# EAGLE design NEW-PCB (EAGLE 9.0.0)
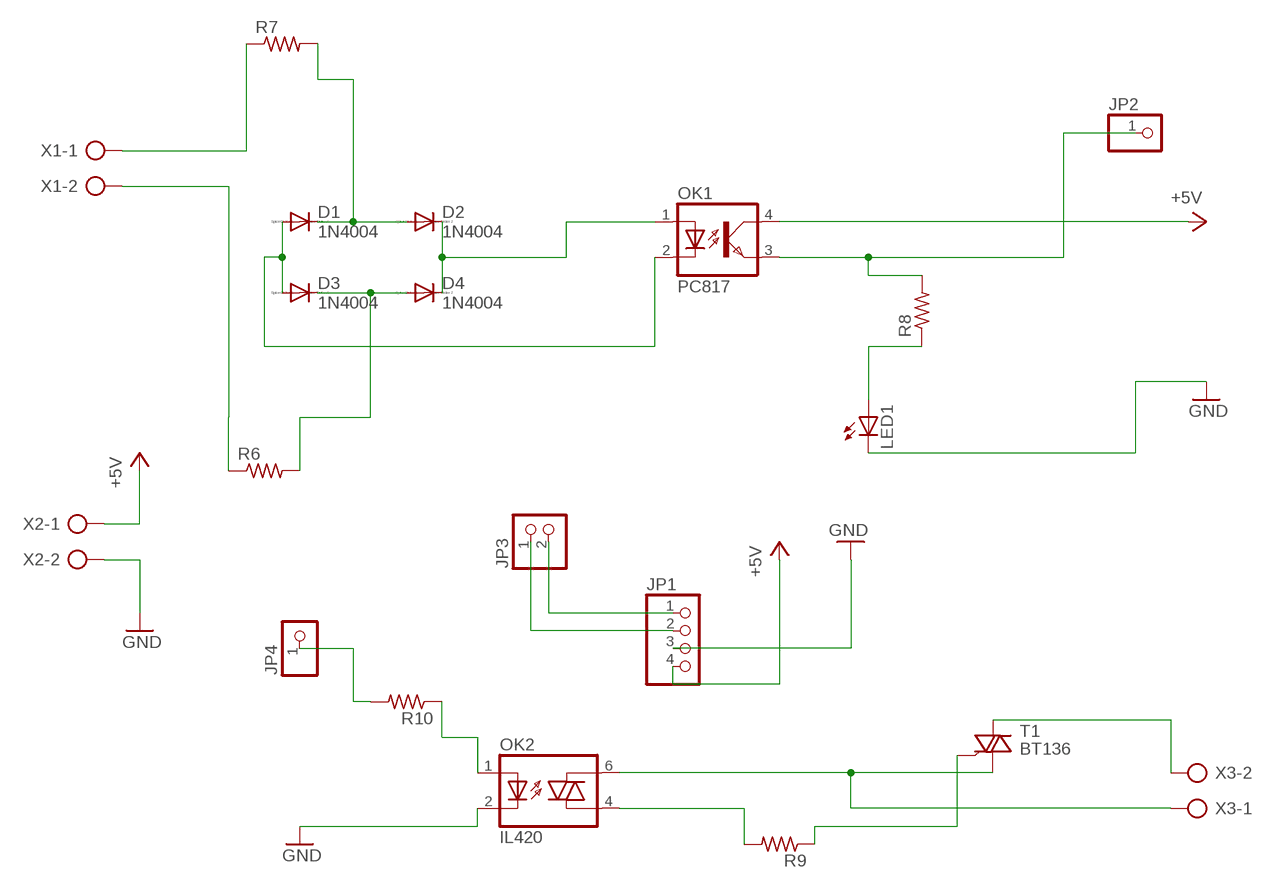
[diagram p0: schematic, sheet 1]

## Parts
D1  1N4004  [DO41-10]
D2  1N4004  [DO41-10]
D3  1N4004  [DO41-10]
D4  1N4004  [DO41-10]
JP1  PINHD-1X4  [1X04]
JP2  PINHD-1X1  [1X01]
JP3  PINHD-1X2  [1X02]
JP4  PINHD-1X1  [1X01]
LED1  LED5MM  [LED5MM]
OK1  PC817  [DIL04]
OK2  IL420  [DIL06]
R6  R-US_0411/15  [0411/15]
R7  R-US_0411/15  [0411/15]
R8  R-US_0411/15  [0411/15]
R9  R-US_0411/15  [0411/15]
R10  R-US_0411/15  [0411/15]
T1  BT136  [TO220AB]
X1  AK300/2  [AK300/2]
X2  AK300/2  [AK300/2]
X3  AK300/2  [AK300/2]

## Nets
+5V: JP1.4 OK1.4(COL) X2.1
GND: JP1.3 LED1.K(C) OK2.2(C) X2.2
N$1: R7.1 X1.1
N$2: R6.1 X1.2
N$3: D3.C D4.A R6.2
N$4: D1.C D2.A R7.2
N$5: D1.A D3.A OK1.2(C)
N$6: D2.C D4.C OK1.1(A)
N$7: JP1.1 JP3.2
N$8: LED1.A R8.1
N$9: JP2.1 OK1.3(EMIT) R8.2
N$10: JP1.2 JP3.1
N$11: JP4.1 R10.2
N$12: OK2.1(A) R10.1
N$13: OK2.6(A2) T1.1(A1) X3.1
N$14: T1.2(A2) X3.2
N$15: OK2.4(A1) R9.2
N$16: R9.1 T1.3(G)

## Library data of the parts
D1-D4 = diode:1N4004: DIODE general purpose rectifier, 1 A
JP1 = pinhead:PINHD-1X4: PIN HEADER
JP2 JP4 = pinhead:PINHD-1X1: PIN HEADER
JP3 = pinhead:PINHD-1X2: PIN HEADER
LED1 = led:LED: LED OSRAM: - CHIPLED LG R971, LG N971, LY N971, LG Q971, LY Q971, LO R971, LY R971 LH N974, LH R974 LS Q976, LO Q976, LY Q976 LO Q996 - Hyper CHIPLED LW Q18S LB Q993, LB Q99A, LB R99A - SideLED LS A670, LO A670, LY A670, LG A670, LP A670 LB A673, LV A673, LT A673, LW A673 LH A674 LY A675 LS A676, LA A676, LO A676, LY A676, LW A676 LS A679, LY A679, LG A679 - Hyper Micro SIDELED® LS Y876, LA Y876, LO Y876, LY Y876 LT Y87S - SmartLED LW L88C, LW L88S LB L89C, LB L89S, LG L890 LS L89K, LO L89K, LY L89K LS L896, LA L896, LO L896, LY L896 - TOPLED LS T670, LO T670, LY T670, LG T670, LP T670 LSG T670, LSP T670, LSY T670, LOP T670, LYG T670 LG T671, LOG T671, LSG T671 LB T673, LV T673, LT T673, LW T673 LH T674 LS T676, LA T676, LO T676, LY T676, LB T676, LH T676, LSB T676, LW T676 LB T67C, LV T67C, LT T67C, LS T67K, LO T67K, LY T67K, LW E67C LS E67B, LA E67B, LO E67B, LY E67B, LB E67C, LV E67C, LT E67C LW T67C LS T679, LY T679, LG T679 LS T770, LO T770, LY T770, LG T770, LP T770 LB T773, LV T773, LT T773, LW T773 LH T774 LS E675, LA E675, LY E675, LS T675 LS T776, LA T776, LO T776, LY T776, LB T776 LHGB T686 LT T68C, LB T68C - Hyper Mini TOPLED® LB M676 - Mini TOPLED Santana® LG M470 LS M47K, LO M47K, LY M47K Source: http://www.osram.convergy.de LUXEON: - LUMILED® LXK2-PW12-R00, LXK2-PW12-S00, LXK2-PW14-U00, LXK2-PW14-V00 LXK2-PM12-R00, LXK2-PM12-S00, LXK2-PM14-U00 LXK2-PE12-Q00, LXK2-PE12-R00, LXK2-PE12-S00, LXK2-PE14-T00, LXK2-PE14-U00 LXK2-PB12-K00, LXK2-PB12-L00, LXK2-PB12-M00, LXK2-PB14-N00, LXK2-PB14-P00, LXK2-PB14-Q00 LXK2-PR12-L00, LXK2-PR12-M00, LXK2-PR14-Q00, LXK2-PR14-R00 LXK2-PD12-Q00, LXK2-PD12-R00, LXK2-PD12-S00 LXK2-PH12-R00, LXK2-PH12-S00 LXK2-PL12-P00, LXK2-PL12-Q00, LXK2-PL12-R00 Source: www.luxeon.com KINGBRIGHT: KA-3528ASYC Source: www.kingbright.com
OK1 = optocoupler:PC817: SHARP OPTO COUPLER; MPN: PC817X4J000F; OC_FARNELL: 9707727; OC_NEWARK: 97K7059
OK2 = optocoupler:IL420: SIEMENS OPTO COUPLER; MF: VISHAY/TELEFUNKEN; MPN: IL420; OC_FARNELL: 1469561; OC_NEWARK: 58K1719
R6-R10 = resistor:R-US_: RESISTOR, American symbol
T1 = triac:BT136: Triac BT136 series E sensitive gate Source: http://www.nxp.com/acrobat_download/datasheets/BT136_SERIES_E_2.pdf
X1-X3 = con-ptr500:AK300/2: CONNECTOR; OC_FARNELL: unknown; OC_NEWARK: unknown

## Board
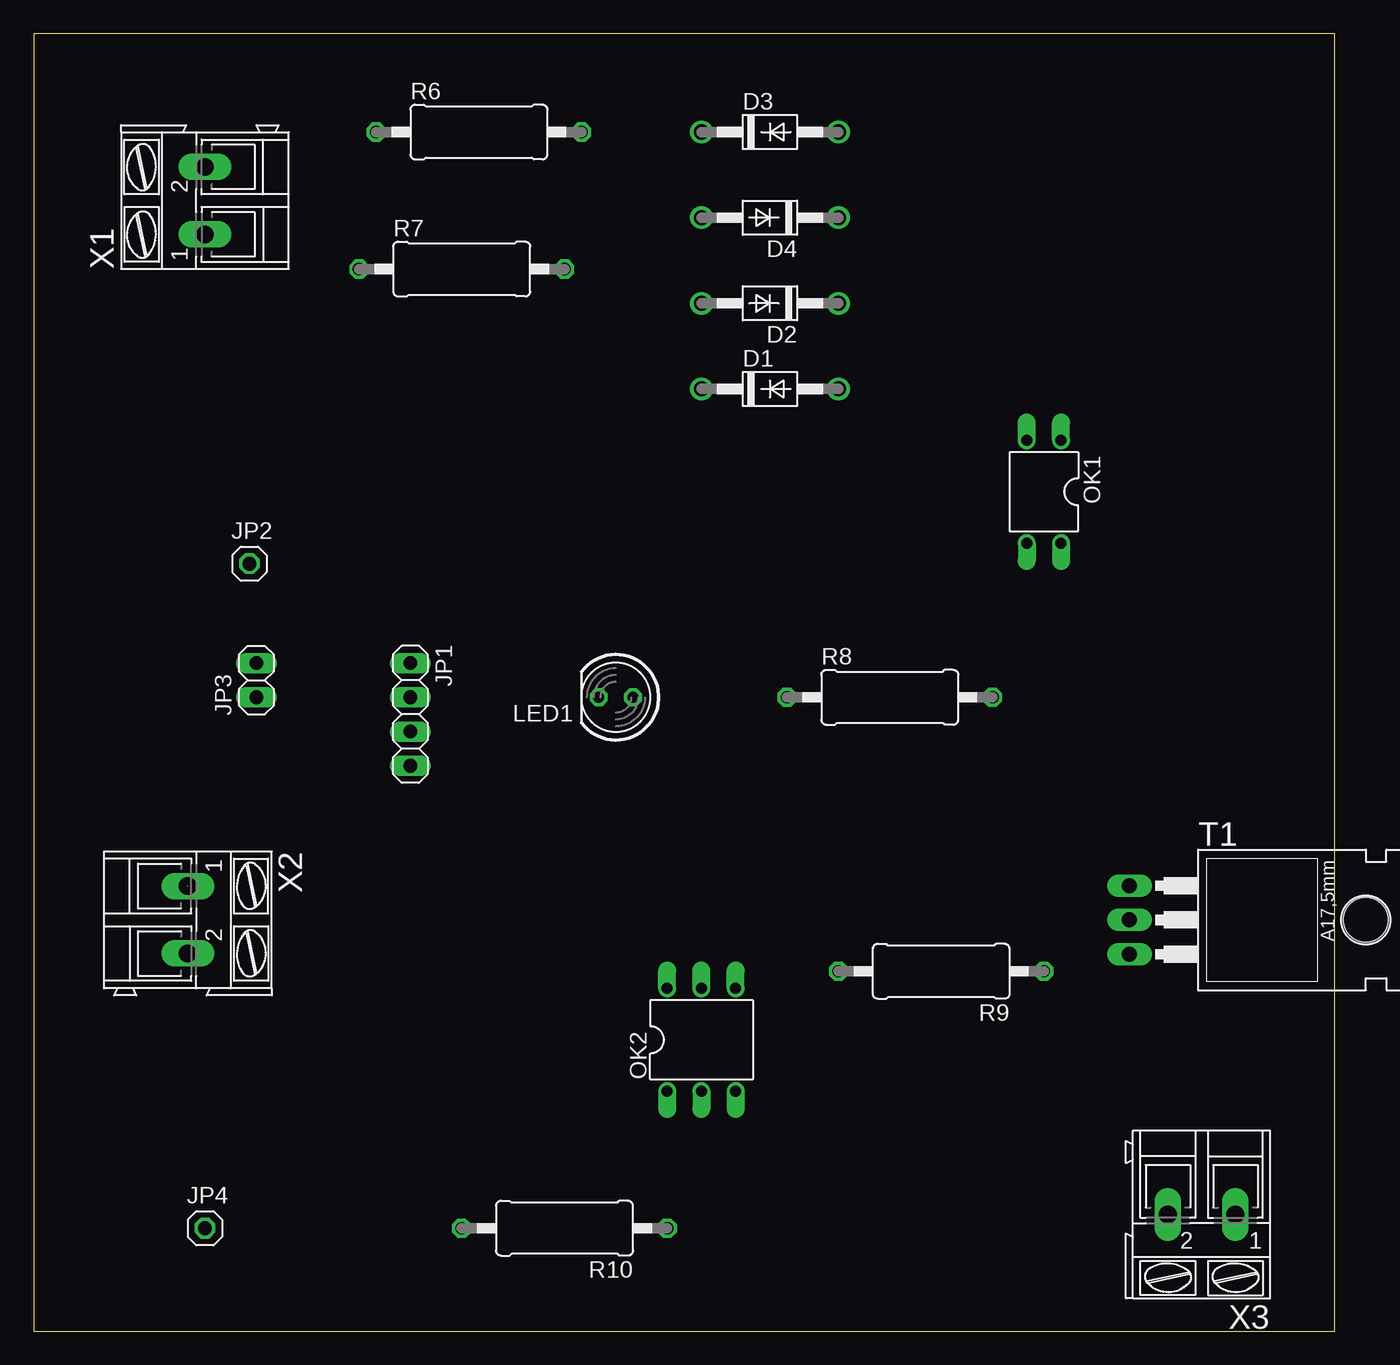
[diagram p1: board, top side]
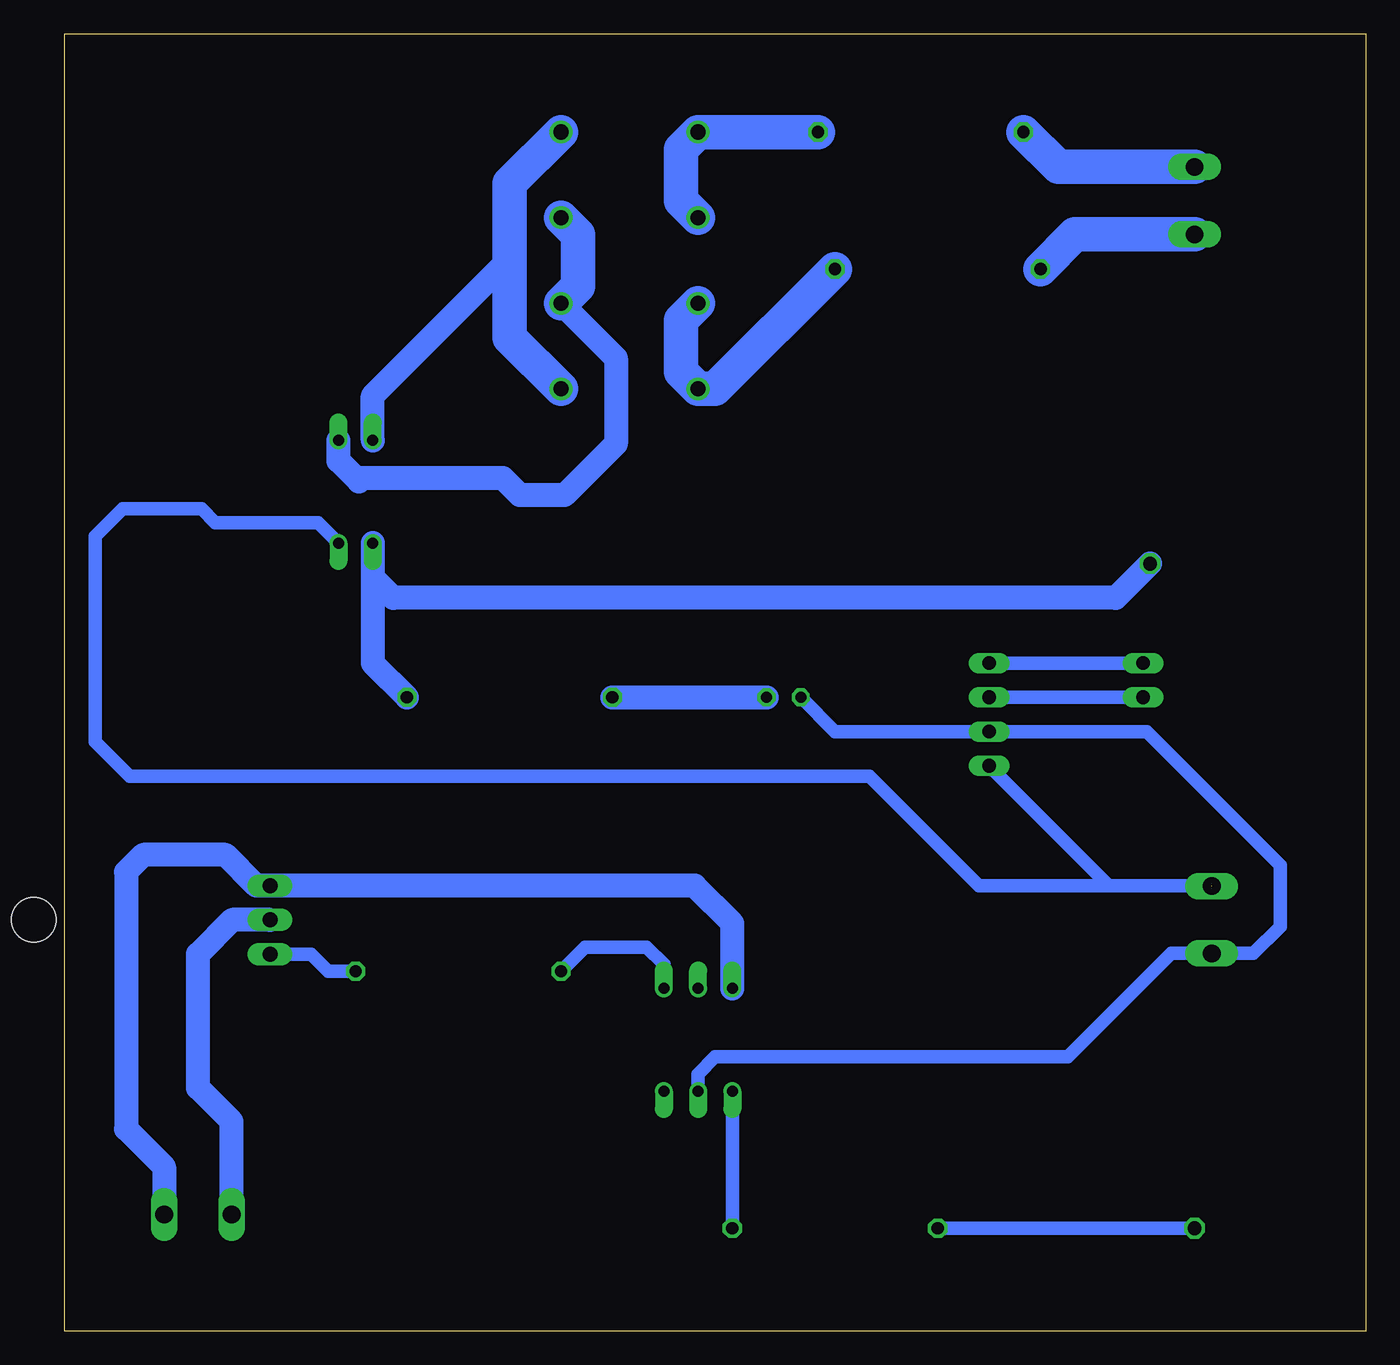
[diagram p2: board, bottom side, seen from below]

Size 96.5 x 96.19 mm. Coordinates in mm from the lower left corner, seen from the top.
Outline: 0,0 96.5,0 96.5,96.19 0,96.19 0,0
Copper layers (1*16): Top 0.035mm / dielectric 1.5mm / Bottom 0.035mm
Design rules "default": minimum track width 6mil, minimum drill 0.35mm, track to track 6mil, track to pad 6mil, pad to pad 6mil, via to via 6mil, smd to smd 6mil, copper to edge 40mil, drill to drill 6mil, minimum pad ring 10mil, minimum via ring 8mil, stop-mask expansion 4mil, vias tented up to drill 0mil, thermal gap 10mil

### Footprints (pad centres in the part's own frame; a part is rotated, then mirrored left to right if it is on the bottom)
DO41-10 = drill 1.118: A 5.08,0; C -5.08,0
1X04 = drill 1.016 long: 1 -3.81,0; 2 -1.27,0; 3 1.27,0; 4 3.81,0
1X01 = drill 1.016 octagon: 1 0,0
1X02 = drill 1.016 long: 1 -1.27,0; 2 1.27,0
LED5MM = drill 0.813 octagon: A -1.27,0; K 1.27,0
DIL04 = drill 0.813 offset: 1 -1.27,-3.81; 2 1.27,-3.81; 3 1.27,3.81; 4 -1.27,3.81
DIL06 = drill 0.813 offset: 1 -2.54,-3.81; 2 0,-3.81; 3 2.54,-3.81; 4 2.54,3.81; 5 0,3.81; 6 -2.54,3.81
0411/15 = drill 0.914 octagon: 1 -7.62,0; 2 7.62,0
TO220AB = drill 1.118 long: 1 -2.54,-6.35; 2 0,-6.35; 3 2.54,-6.35 | hole 3.302: 0,11.176
AK300/2 = drill 1.321 long: 1 -2.515,0; 2 2.489,0

### Placement (x,y rotation side)
D1  54.61,69.85 0 top
D2  54.61,76.2 180 top
D3  54.61,88.9 0 top
D4  54.61,82.55 180 top
JP1  27.94,45.72 270 top
JP2  16,56.9 0 top
JP3  16.51,48.26 90 top
JP4  12.7,7.62 0 top
LED1  43.18,46.99 180 top
OK1  74.93,62.23 180 top
OK2  49.53,21.59 0 top
R6  33.02,88.9 0 top
R7  31.75,78.74 0 top
R8  63.5,46.99 0 top
R9  67.31,26.67 180 top
R10  39.37,7.62 180 top
T1  87.63,30.48 270 top
X1  12.7,83.82 90 top
X2  11.43,30.48 270 top
X3  86.61,8.64 180 top

### Tracks (layer width: path | path; a pad name or v marks a point on that pad's centre or on a via)
+5V  (1 unrouted)
  Bottom 1.016: JP1.4 19.05,33.02 | 19.05,33.02 18.03,33.02 11.43,33.02 | OK1.4 77.72,59.94 85.34,59.94 86.36,60.96 92.2,60.96 94.23,58.93 94.23,43.69 91.69,41.15 36.83,41.15 28.7,33.02 19.05,33.02
GND
  Bottom 1.016: OK2.2 49.53,19.05 48.26,20.32 22.1,20.32 14.43,27.99 X2.2 8.33,27.99 6.35,29.97 6.35,34.54 16.26,44.45 JP1.3 39.37,44.45 LED1.K
N$1
  Bottom 2.54: X1.1 21.57,81.31 R7.1
N$2
  Bottom 2.54: X1.2 22.81,86.31 R6.1
N$3
  Bottom 2.54: R6.2 D3.C 50.8,87.63 50.8,83.82 D4.A
N$4
  Bottom 2.54: R7.2 48.26,69.85 D1.C 50.8,71.12 50.8,74.93 D2.A
N$5
  Bottom 1.778: OK1.2 73.66,69.34 63.5,79.5
  Bottom 2.54: D3.A 63.5,85.09 63.5,79.5 63.5,73.66 D1.A
N$6
  Bottom 1.778: D2.C 55.63,72.14 55.63,65.79 59.44,61.98 62.74,61.98 64.01,63.25 74.42,63.25 74.68,62.99 76.2,64.52 OK1.1
  Bottom 2.54: D4.C 58.42,81.28 58.42,77.47 D2.C
N$7
  Bottom 1.016: JP3.2 JP1.1
N$8
  Bottom 1.778: R8.1 LED1.A
N$9
  Bottom 1.778: OK1.3 73.66,55.88 | 73.66,55.88 73.66,49.53 R8.2 | JP2.1 18.54,54.36 72.14,54.36 73.66,55.88
N$10
  Bottom 1.016: JP1.2 JP3.1
N$11
  Bottom 1.016: R10.2 JP4.1
N$12
  Bottom 1.016: OK2.1 R10.1
N$13
  Bottom 1.778: X3.1 89.13,12.17 91.95,14.99 91.95,34.04 90.68,35.31 84.58,35.31 82.3,33.02 T1.1 49.78,33.02 46.99,30.23 OK2.6
N$14
  Bottom 1.778: T1.2 84.07,30.48 86.61,27.94 86.61,18.03 84.12,15.54 X3.2
N$15
  Bottom 1.016: OK2.4 52.07,27.18 53.34,28.45 57.91,28.45 R9.2
N$16
  Bottom 1.016: R9.1 76.96,26.67 78.23,27.94 T1.3